# Altium schematic sheet EPS_3V3_EMI-Filter_In.SchDoc: 3V3 / EMI-Filter / In
size A4
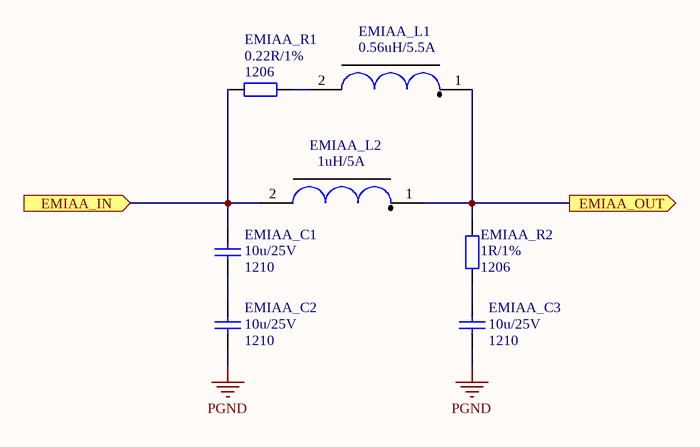
[diagram p0: EPS_3V3_EMI-Filter_In.SchDoc]

## Parts
EMIAA_C1  Package: 1210  [SMD_Capacitor_1210]  (hidden comment: 10u/25V)
EMIAA_C2  Package: 1210  [SMD_Capacitor_1210]  (hidden comment: 10u/25V)
EMIAA_C3  Package: 1210  [SMD_Capacitor_1210]  (hidden comment: 10u/25V)
EMIAA_L1  0.56uH/5.5A  [Vishay_IHLP1212]
EMIAA_L2  1uH/5A  [Vishay_IHLP1212]
EMIAA_R1  Package: 1206  [SMD_Resistor_1206]  (hidden comment: 0.22R/1%)
EMIAA_R2  Package: 1206  [SMD_Resistor_1206]  (hidden comment: 1R/1%)

## Ports
EMIAA_IN (in), EMIAA_OUT (out)

## Nets
PGND: EMIAA_C2.2 EMIAA_C3.2
EMIAA_IN: EMIAA_C1.1 EMIAA_L2.2 EMIAA_R1.1 ; port EMIAA_IN
EMIAA_OUT: EMIAA_L1.1 EMIAA_L2.1 EMIAA_R2.2 ; port EMIAA_OUT
NetEMIAA_C1_2: EMIAA_C1.2 EMIAA_C2.1
NetEMIAA_C3_1: EMIAA_C3.1 EMIAA_R2.1
NetEMIAA_L1_2: EMIAA_L1.2 EMIAA_R1.2

## Notes on the sheet
- Title:
- Project:
- Author:
- Model:
- Document Number:
- Checked by:
- Rev:
- Date:
- Approved by:
- Sheet:
- of
- File name:

## Library data of the parts
EMIAA_C1-EMIAA_C3 = Cer_GCJ32ER71E106KA12L: Ceramic Cap Murata Automotive 10u/25V X7R 1210; Manufacturer: Murata; ManufacturerPartNumber: GCJ32ER71E106KA12L; Value: 10u/25V
EMIAA_L1 = IHLP1212BZERR56M11: Vishay IHLP1212 Inductor, L=0.56uH, Irise40deg=5.5A, ESR=16mR, SRF=1MHz.; Manufacturer: Vishay; ManufacturerPartNumber: IHLP1212BZERR56M11; Value: 0.56uH/5.5A
EMIAA_L2 = IHLP1212BZER1R0M11: Vishay IHLP1212 Inductor, L=1uH, Irise40deg=5A, ESR=20mR, SRF=1MHz.; Manufacturer: Vishay; ManufacturerPartNumber: IHLP1212BZER1R0M11; Value: 1uH/5A
EMIAA_R1 = ERJ-8BQFR22V: Panasonic Resistor 0.22R 1% 1206 330mW; Manufacturer: Panasonic; ManufacturerPartNumber: ERJ-8BQFR22V; Value: 0.22R/1%
EMIAA_R2 = ERJ-8BQF1R0V: Panasonic Resistor 1R 1% 1206 330mW; ManufacturerPartNumber: ERJ-8BQF1R0V; Manufacturer: Panasonic; Value: 1R/1%